# Altium schematic sheet Signal Conditioning.SchDoc
size 406 x 304 mm; SheetNumber: 11; SheetTotal: 18
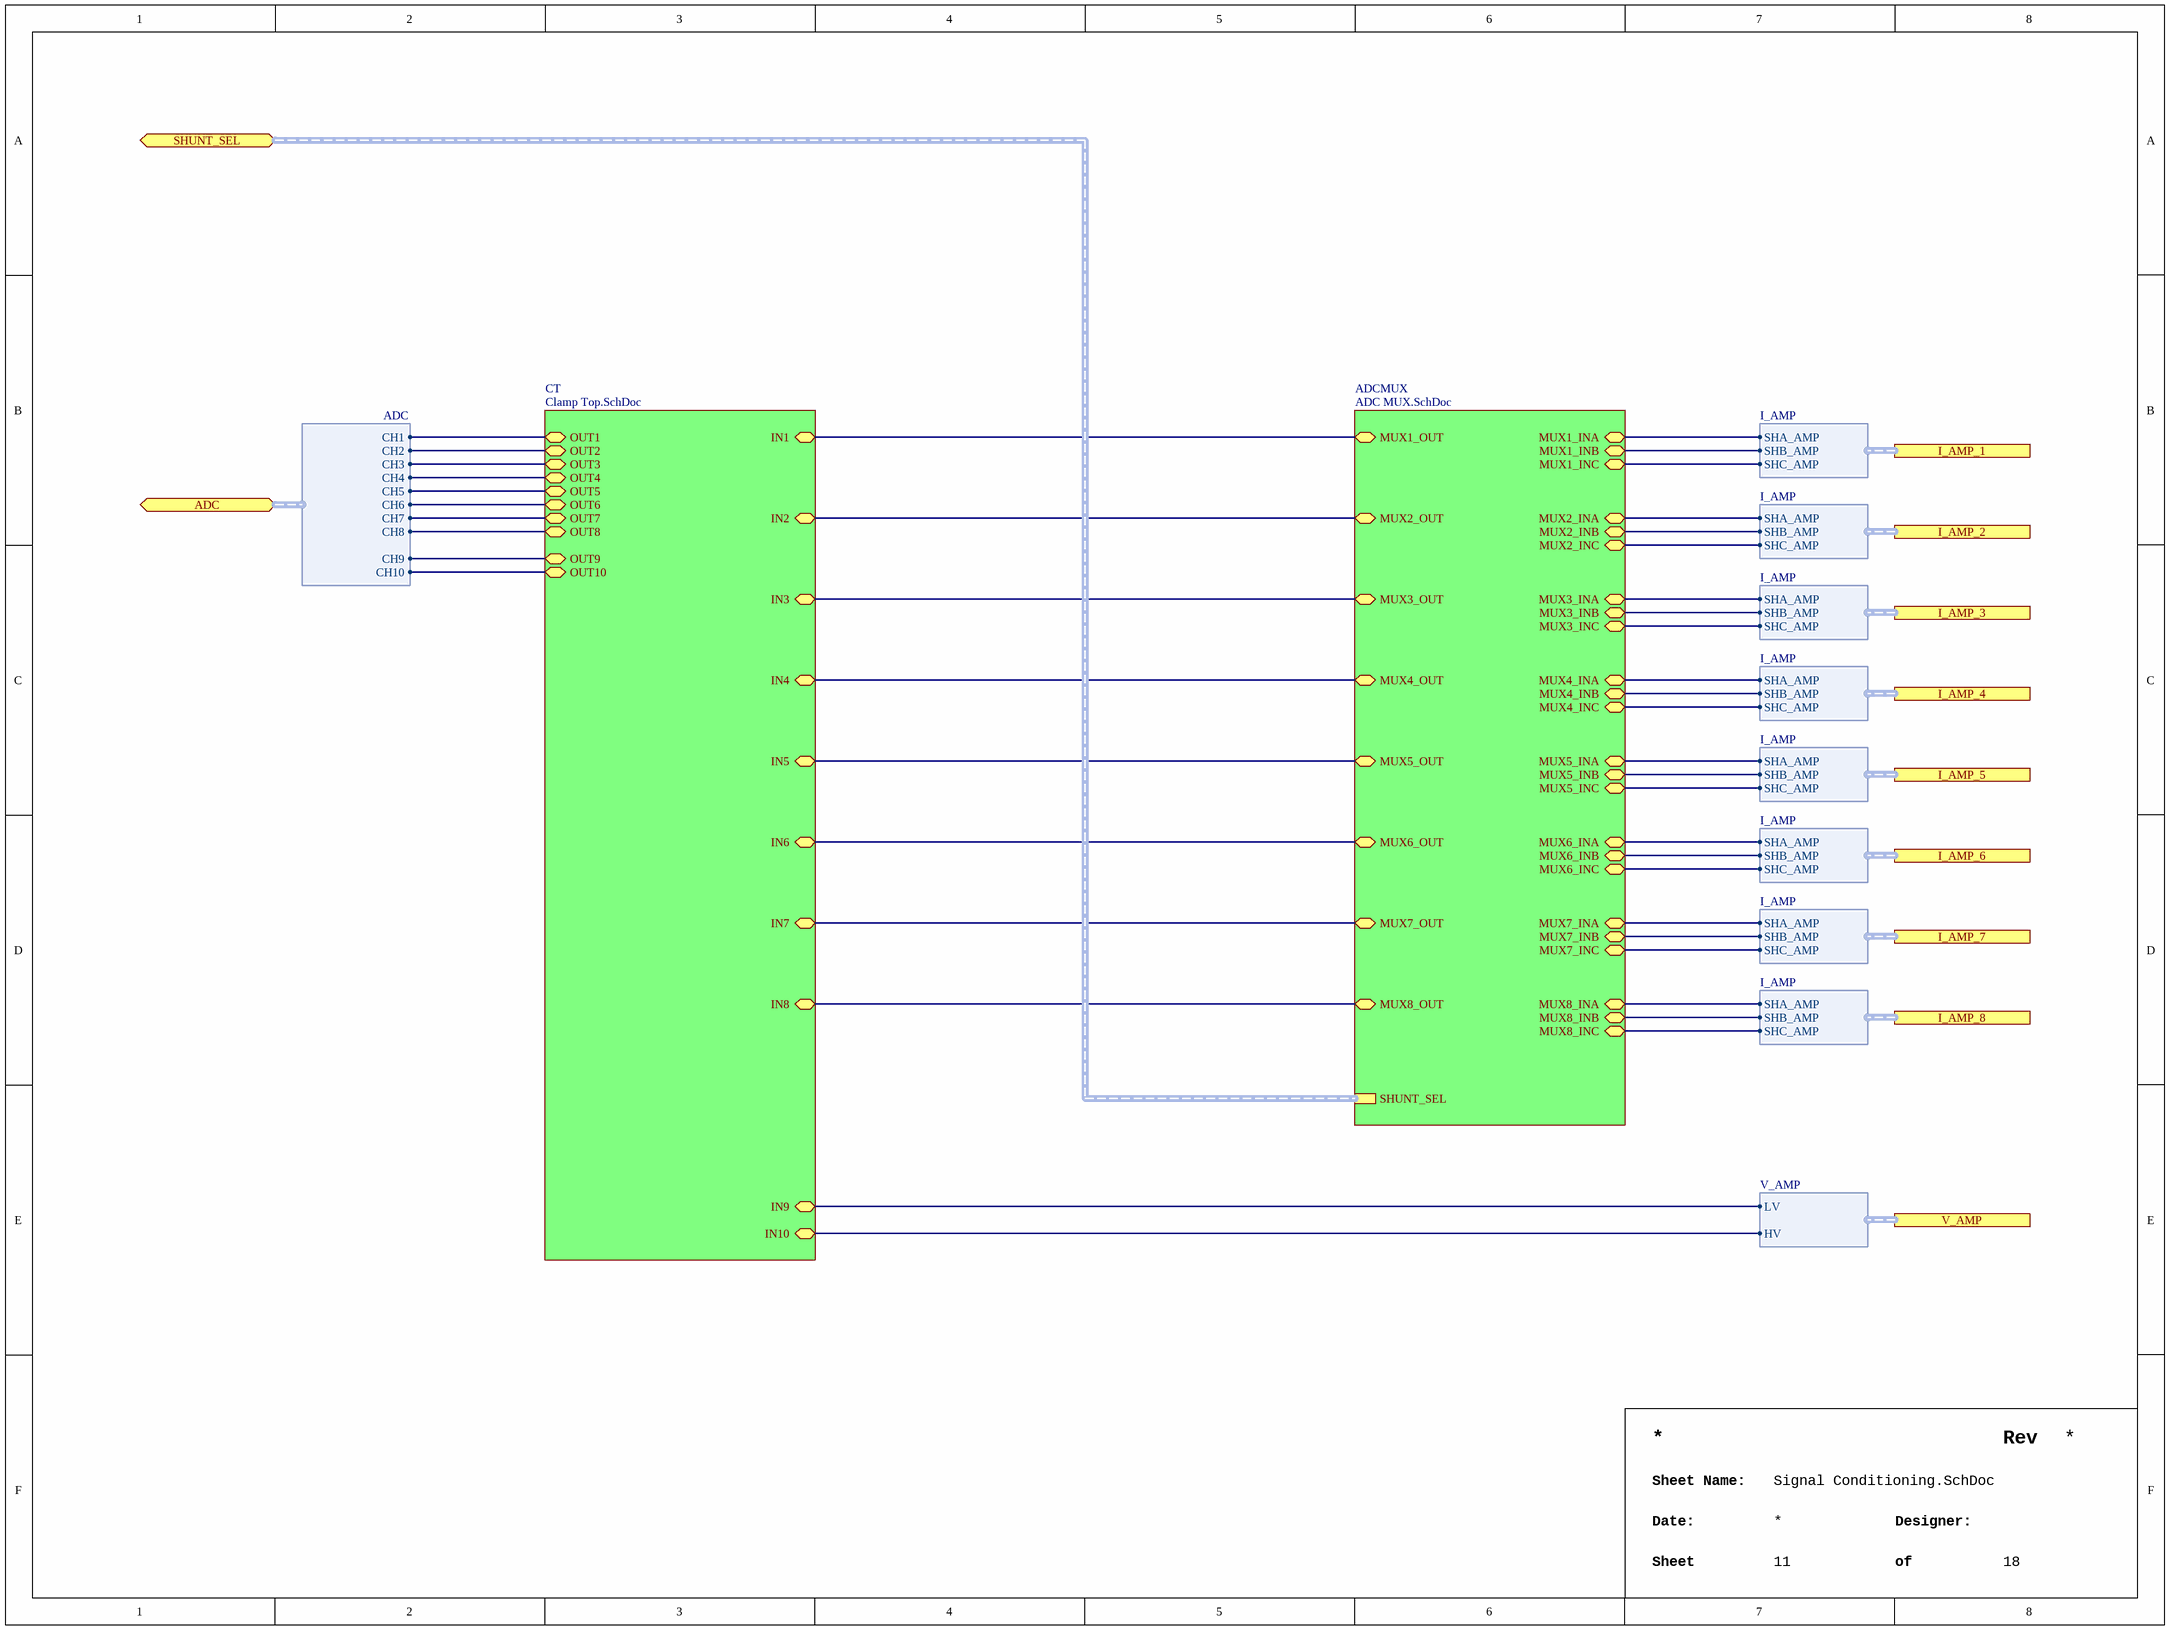
[diagram p0: Signal Conditioning.SchDoc]

## Sub-sheets
ADCMUX = ADC MUX.SchDoc: MUX1_OUT (bidir), SHUNT_SEL (harness SHUNT_SEL), MUX1_INA (bidir), MUX1_INB (bidir), MUX1_INC (bidir), MUX2_OUT (bidir), MUX2_INA (bidir), MUX2_INB (bidir), MUX2_INC (bidir), MUX3_OUT (bidir), MUX3_INA (bidir), MUX3_INB (bidir), MUX3_INC (bidir), MUX4_OUT (bidir), MUX4_INA (bidir), MUX4_INB (bidir), MUX4_INC (bidir), MUX5_OUT (bidir), MUX5_INA (bidir), MUX5_INB (bidir), MUX5_INC (bidir), MUX6_OUT (bidir), MUX6_INA (bidir), MUX6_INB (bidir), MUX6_INC (bidir), MUX7_INA (bidir), MUX7_INB (bidir), MUX7_INC (bidir), MUX8_INA (bidir), MUX8_INB (bidir), MUX8_INC (bidir), MUX7_OUT (bidir), MUX8_OUT (bidir)
CT = Clamp Top.SchDoc: IN10 (bidir), IN1 (bidir), IN2 (bidir), IN3 (bidir), IN4 (bidir), IN5 (bidir), IN6 (bidir), IN7 (bidir), IN8 (bidir), IN9 (bidir), OUT10 (bidir), OUT1 (bidir), OUT2 (bidir), OUT3 (bidir), OUT4 (bidir), OUT5 (bidir), OUT6 (bidir), OUT7 (bidir), OUT8 (bidir), OUT9 (bidir)

## Ports
ADC (bidir, harness ADC), I_AMP_1 (harness I_AMP), I_AMP_2 (harness I_AMP), I_AMP_3 (harness I_AMP), I_AMP_4 (harness I_AMP), I_AMP_5 (harness I_AMP), I_AMP_6 (harness I_AMP), I_AMP_7 (harness I_AMP), I_AMP_8 (harness I_AMP), SHUNT_SEL (bidir, harness SHUNT_SEL), V_AMP (harness V_AMP)

## Harnesses
I_AMP: SHA_AMP, SHB_AMP, SHC_AMP
V_AMP: HV, LV
ADC: CH10, CH1, CH2, CH3, CH4, CH5, CH6, CH7, CH8, CH9

## Nets
(unnamed): sheet ADCMUX/MUX1_OUT, sheet CT/IN1
(unnamed): sheet ADCMUX/MUX1_INA, port I_AMP_1.SHA_AMP
(unnamed): sheet ADCMUX/MUX1_INB, port I_AMP_1.SHB_AMP
(unnamed): sheet ADCMUX/MUX1_INC, port I_AMP_1.SHC_AMP
(unnamed): sheet ADCMUX/MUX2_OUT, sheet CT/IN2
(unnamed): sheet ADCMUX/MUX2_INA, port I_AMP_2.SHA_AMP
(unnamed): sheet ADCMUX/MUX2_INB, port I_AMP_2.SHB_AMP
(unnamed): sheet ADCMUX/MUX2_INC, port I_AMP_2.SHC_AMP
(unnamed): sheet ADCMUX/MUX3_OUT, sheet CT/IN3
(unnamed): sheet ADCMUX/MUX3_INA, port I_AMP_3.SHA_AMP
(unnamed): sheet ADCMUX/MUX3_INB, port I_AMP_3.SHB_AMP
(unnamed): sheet ADCMUX/MUX3_INC, port I_AMP_3.SHC_AMP
(unnamed): sheet ADCMUX/MUX4_OUT, sheet CT/IN4
(unnamed): sheet ADCMUX/MUX4_INA, port I_AMP_4.SHA_AMP
(unnamed): sheet ADCMUX/MUX4_INB, port I_AMP_4.SHB_AMP
(unnamed): sheet ADCMUX/MUX4_INC, port I_AMP_4.SHC_AMP
(unnamed): sheet ADCMUX/MUX5_OUT, sheet CT/IN5
(unnamed): sheet ADCMUX/MUX5_INA, port I_AMP_5.SHA_AMP
(unnamed): sheet ADCMUX/MUX5_INB, port I_AMP_5.SHB_AMP
(unnamed): sheet ADCMUX/MUX5_INC, port I_AMP_5.SHC_AMP
(unnamed): sheet ADCMUX/MUX6_OUT, sheet CT/IN6
(unnamed): sheet ADCMUX/MUX6_INA, port I_AMP_6.SHA_AMP
(unnamed): sheet ADCMUX/MUX6_INB, port I_AMP_6.SHB_AMP
(unnamed): sheet ADCMUX/MUX6_INC, port I_AMP_6.SHC_AMP
(unnamed): sheet ADCMUX/MUX7_INA, port I_AMP_7.SHA_AMP
(unnamed): sheet ADCMUX/MUX7_INB, port I_AMP_7.SHB_AMP
(unnamed): sheet ADCMUX/MUX7_INC, port I_AMP_7.SHC_AMP
(unnamed): sheet ADCMUX/MUX8_INA, port I_AMP_8.SHA_AMP
(unnamed): sheet ADCMUX/MUX8_INB, port I_AMP_8.SHB_AMP
(unnamed): sheet ADCMUX/MUX8_INC, port I_AMP_8.SHC_AMP
(unnamed): sheet ADCMUX/MUX7_OUT, sheet CT/IN7
(unnamed): sheet ADCMUX/MUX8_OUT, sheet CT/IN8
(unnamed): sheet CT/IN10, port V_AMP.HV
(unnamed): sheet CT/IN9, port V_AMP.LV
(unnamed): sheet CT/OUT10, port ADC.CH10
(unnamed): sheet CT/OUT1, port ADC.CH1
(unnamed): sheet CT/OUT2, port ADC.CH2
(unnamed): sheet CT/OUT3, port ADC.CH3
(unnamed): sheet CT/OUT4, port ADC.CH4
(unnamed): sheet CT/OUT5, port ADC.CH5
(unnamed): sheet CT/OUT6, port ADC.CH6
(unnamed): sheet CT/OUT7, port ADC.CH7
(unnamed): sheet CT/OUT8, port ADC.CH8
(unnamed): sheet CT/OUT9, port ADC.CH9

## Buses and harness runs
harness port SHUNT_SEL = sheet ADCMUX/SHUNT_SEL

## Notes on the sheet
- Rev
- Sheet Name:
- Date:
- Sheet
- Designer:
- of